# EAGLE schematic uln_0.02 (EAGLE 8.0.0)
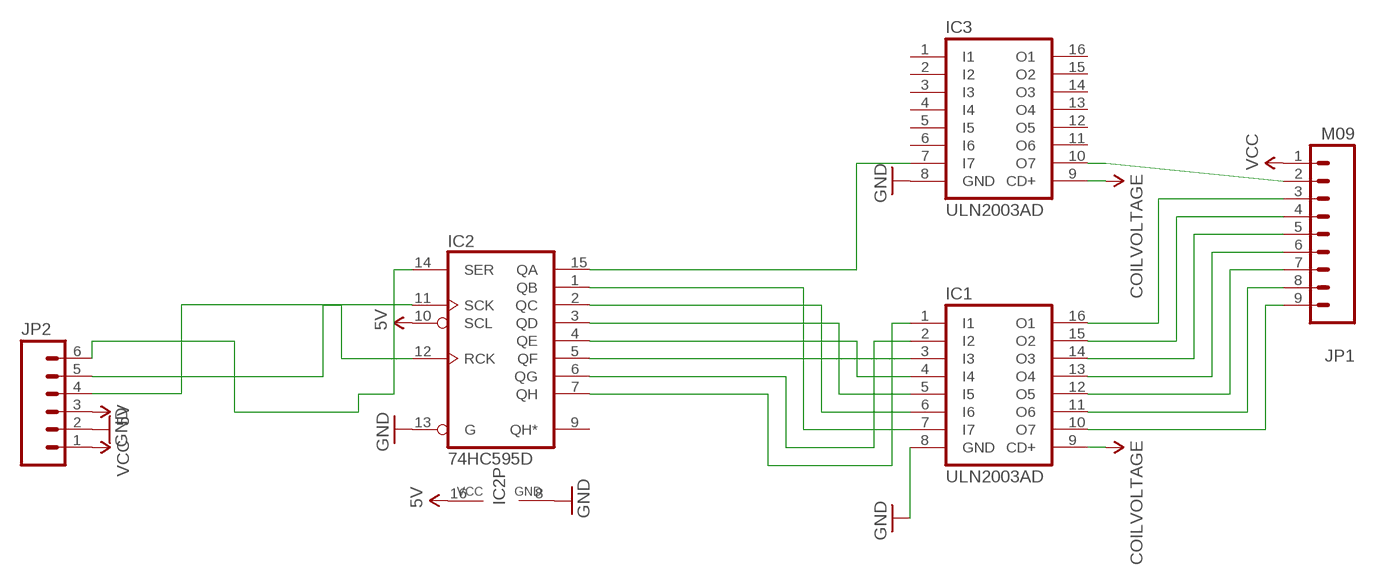
[diagram p0: schematic, sheet 1]

## Parts
IC1  ULN2003AD  [SO16]
IC2  74HC595D  [SO16]
IC3  ULN2003AD  [SO16]
JP1  M09  [1X09]
JP2  M06SIP  [1X06]

## Nets
5V: IC2.10(SCL) IC2.16(VCC) JP2.3
GND: IC1.8(GND) IC2.8(GND) IC2.13(G) IC3.8(GND) JP2.2
N$1: IC1.7(I7) IC2.1(QB)
N$2: IC1.6(I6) IC2.2(QC)
N$3: IC1.5(I5) IC2.3(QD)
N$4: IC1.4(I4) IC2.4(QE)
N$5: IC1.3(I3) IC2.5(QF)
N$6: IC1.2(I2) IC2.6(QG)
N$7: IC1.1(I1) IC2.7(QH)
N$8: IC2.15(QA) IC3.7(I7)
N$9: IC1.10(O7) JP1.9
N$10: IC1.11(O6) JP1.8
N$11: IC1.12(O5) JP1.7
N$12: IC1.13(O4) JP1.6
N$13: IC1.14(O3) JP1.5
N$14: IC1.15(O2) JP1.4
N$15: IC1.16(O1) JP1.3
N$16: IC3.10(O7) JP1.2
N$17: IC2.11(SCK) JP2.4
N$18: IC2.12(RCK) JP2.5
N$19: IC2.14(SER) JP2.6
VCC: IC1.9(CD+) IC3.9(CD+) JP1.1 JP2.1 ; supply symbol labelled COILVOLTAGE
Unconnected: IC2.9(QH*) IC3.1(I1) IC3.2(I2) IC3.3(I3) IC3.4(I4) IC3.5(I5) IC3.6(I6) IC3.11(O6) IC3.12(O5) IC3.13(O4) IC3.14(O3) IC3.15(O2) IC3.16(O1)

## Library data of the parts
IC1 IC3 = uln-udn:ULN2003A: DRIVER ARRAY
IC2 = 74xx-eu:74*595: 8-bit SHIFT REGISTER, output latch
JP1 = SparkFun:M09: Header 9 Standard 9-pin 0.1" header. Use with straight break away headers (SKU : PRT-00116), right angle break away headers (PRT-00553), swiss pins (PRT-00743), machine pins (PRT-00117), and female headers (PRT-00115).
JP2 = SparkFun:M06: Header 6 Standard 6-pin 0.1" header. Use with straight break away headers (SKU : PRT-00116), right angle break away headers (PRT-00553), swiss pins (PRT-00743), machine pins (PRT-00117), and female headers (PRT-00115). Molex polarized connector foot print use with SKU : PRT-08094 with associated crimp pins and housings. NOTES ON THE VARIANTS LOCK and LOCK_LONGPADS... This footprint was designed to help hold the alignment of a through-hole component (i.e. 6-pin header) while soldering it into place. You may notice that each hole has been shifted either up or down by 0.005 of an inch from it's more standard position (which is a perfectly straight line). This slight alteration caused the pins (the squares in the middle) to touch the edges of the holes. Because they are alternating, it causes a "brace" to hold the component in place. 0.005 has proven to be the perfect amount of "off-center" position when using our standard breakaway headers. Although looks a little odd when you look at the bare footprint, once you have a header in there, the alteration is very hard to notice. Also, if you push a header all the way into place, it is covered up entirely on the bottom side. This idea of altering the position of holes to aid alignment will be further integrated into the Sparkfun Library for other footprints. It can help hold any component with 3 or more connection pins.